# EAGLE design thermostat (EAGLE 7.3.0)
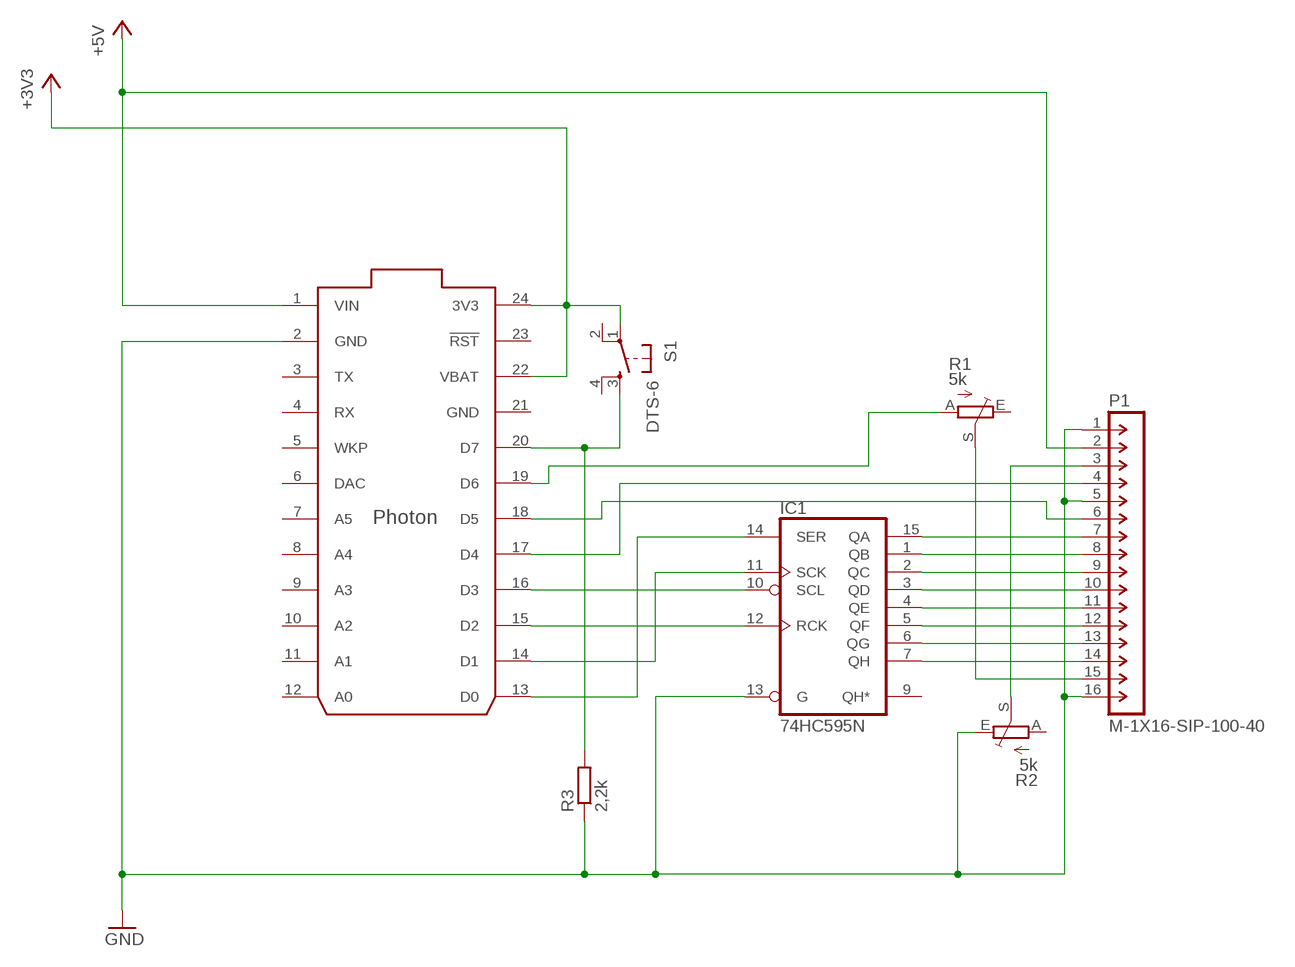
[diagram p0: schematic, sheet 1]

## Parts
IC1  74HC595N  [DIL16]
P1  M-1X16-SIP-100-40  [SIP-100-16-40]
R1  5k  TRIM_EU-B25P  [B25P]
R2  5k  TRIM_EU-B25P  [B25P]
R3  2,2k  R-EU_0207/10  [0207/10]
S1  DTS-6  [DTS-6]
U$1  PHOTON_WITH_HEADERS  [PHOTON]

## Nets
+3V3: S1.1 U$1.22(VBAT) U$1.24(3V3)
+5V: P1.2 U$1.1(VIN)
GND: IC1.13(G) P1.1 P1.5 P1.16 R2.E R3.1 U$1.2(GND)
N$1: IC1.14(SER) U$1.13(D0)
N$2: IC1.11(SCK) U$1.14(D1)
N$3: IC1.12(RCK) U$1.15(D2)
N$4: IC1.10(SCL) U$1.16(D3)
N$5: P1.4 U$1.17(D4)
N$6: P1.6 U$1.18(D5)
N$7: IC1.15(QA) P1.7
N$8: IC1.1(QB) P1.8
N$9: IC1.2(QC) P1.9
N$10: IC1.3(QD) P1.10
N$11: IC1.4(QE) P1.11
N$12: IC1.5(QF) P1.12
N$13: IC1.6(QG) P1.13
N$14: IC1.7(QH) P1.14
N$15: R3.2 S1.3 U$1.20(D7)
N$16: P1.3 R2.S
N$17: R1.A U$1.19(D6)
N$18: P1.15 R1.S
Unconnected: IC1.9(QH*) R1.E R2.A S1.2 S1.4 U$1.3(TX) U$1.4(RX) U$1.5(WKP) U$1.6(DAC) U$1.7(A5) U$1.8(A4) U$1.9(A3) U$1.10(A2) U$1.11(A1) U$1.12(A0) U$1.23(!RST)

## Power pins joined to a net without a drawn wire
GND: IC1.8(GND) U$1.21(GND)
VCC: IC1.16(VCC)

## Library data of the parts
IC1 = 74xx-eu:74*595: 8-bit SHIFT REGISTER, output latch
P1 = con-headers-jp:M-1X16-: MALE HEADER
R1 R2 = pot:TRIM_EU-: POTENTIOMETER
R3 = resistor:R-EU_: RESISTOR, European symbol
S1 = switch-tact:DTS-6
U$1 = Spark:PHOTON

## Board
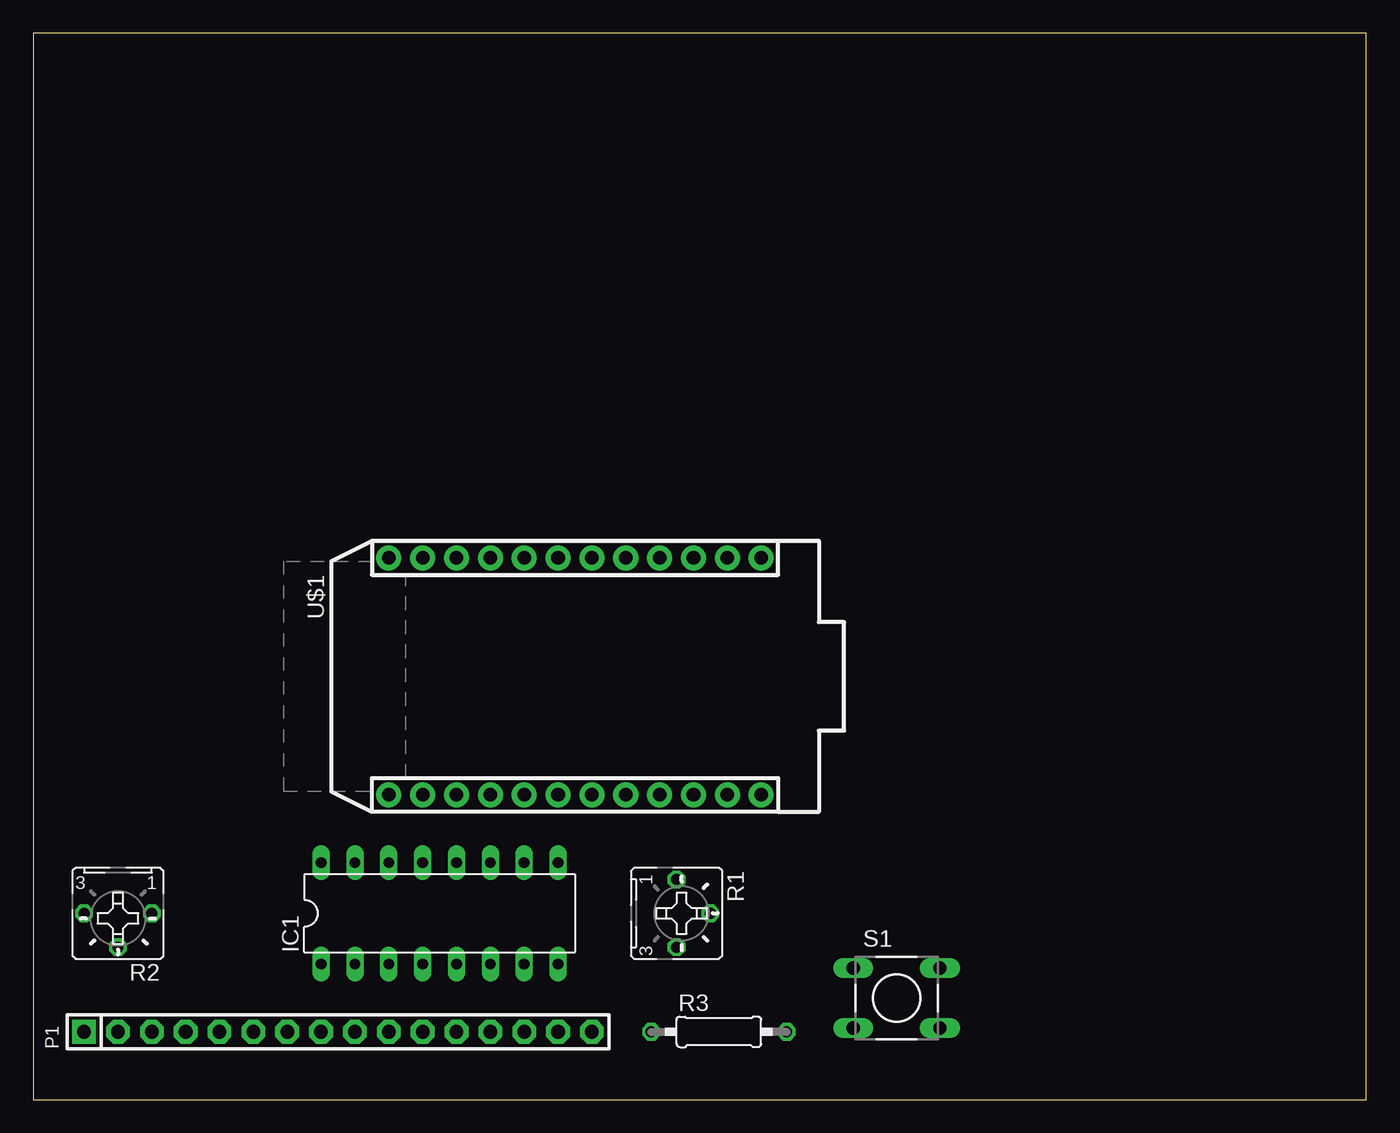
[diagram p1: board, top side]
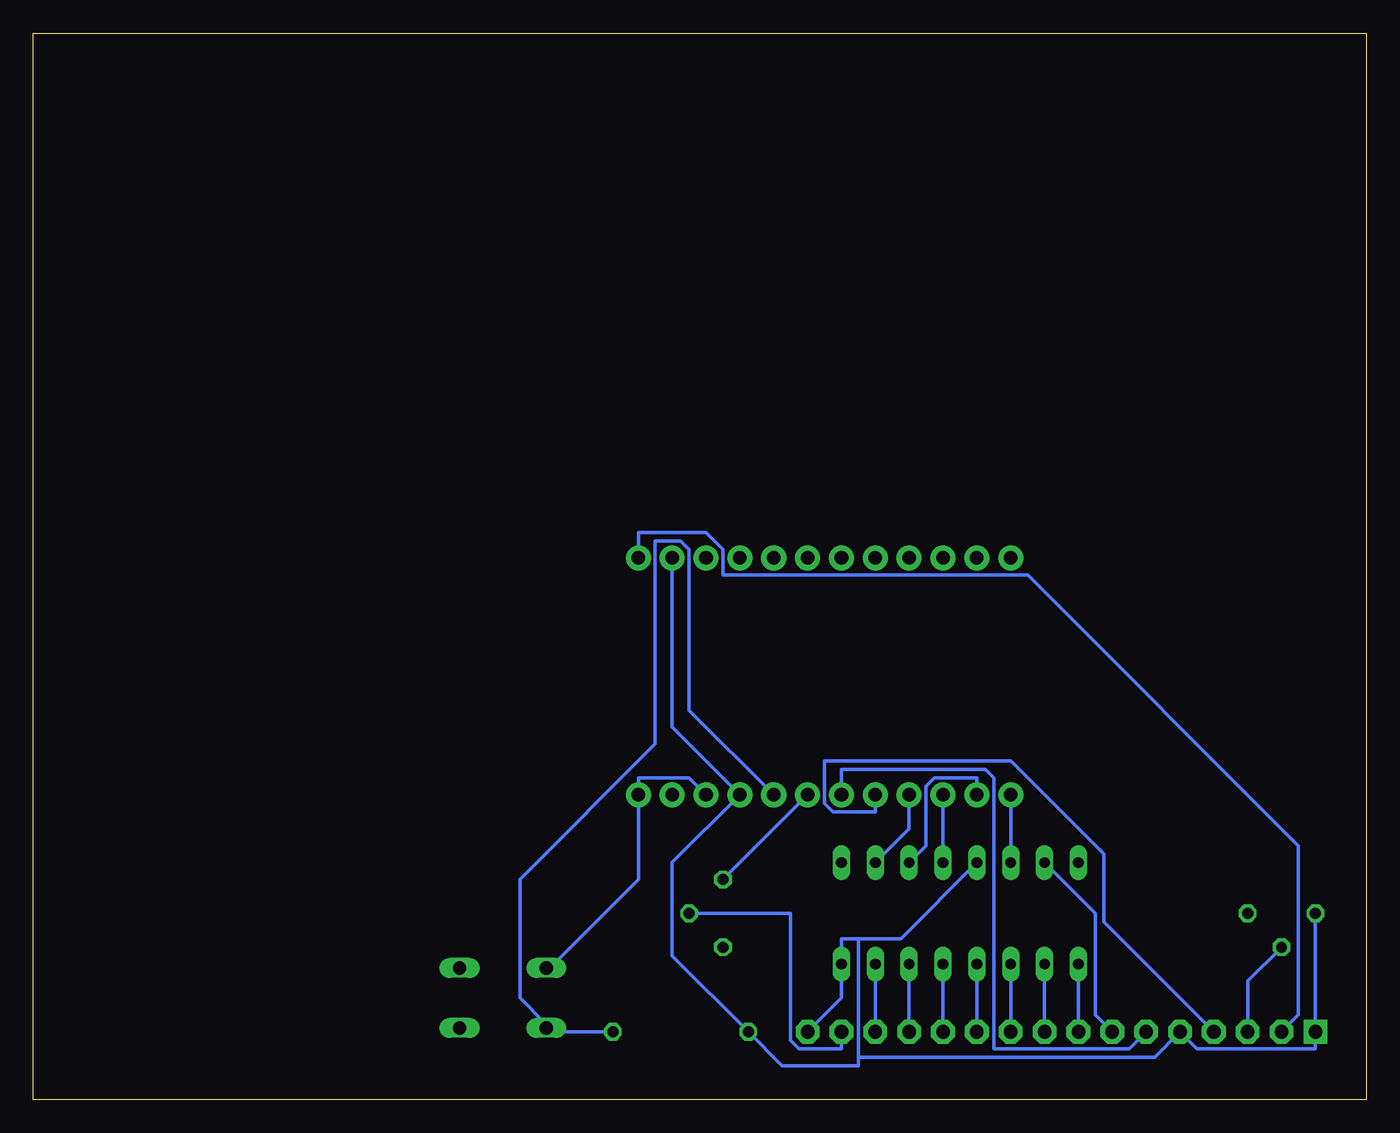
[diagram p2: board, bottom side, seen from below]

Size 100 x 80 mm. Coordinates in mm from the lower left corner, seen from the top.
Outline: 0,0 100,0 100,80 0,80 0,0
Copper layers (1*16): Top 0.035mm / dielectric 1.5mm / Bottom 0.035mm
Design rules "default": minimum track width 10mil, minimum drill 24mil, track to track 8mil, track to pad 8mil, pad to pad 8mil, via to via 8mil, smd to smd 8mil, copper to edge 40mil, drill to drill 8mil, minimum pad ring 10mil, minimum via ring 8mil, stop-mask expansion 4mil, vias tented up to drill 0mil, thermal gap 10mil

### Footprints (pad centres in the part's own frame; a part is rotated, then mirrored left to right if it is on the bottom)
DIL16 = drill 0.813 long: 1 -8.89,-3.81; 2 -6.35,-3.81; 3 -3.81,-3.81; 4 -1.27,-3.81; 5 1.27,-3.81; 6 3.81,-3.81; 7 6.35,-3.81; 8 8.89,-3.81; 9 8.89,3.81; 10 6.35,3.81; 11 3.81,3.81; 12 1.27,3.81; 13 -1.27,3.81; 14 -3.81,3.81; 15 -6.35,3.81; 16 -8.89,3.81
SIP-100-16-40 = drill 1.016 pad 1.778 square: 1 -19.05,0 | drill 1.016 pad 1.778 octagon: 2 -16.51,0; 3 -13.97,0; 4 -11.43,0; 5 -8.89,0; 6 -6.35,0; 7 -3.81,0; 8 -1.27,0; 9 1.27,0; 10 3.81,0; 11 6.35,0; 12 8.89,0; 13 11.43,0; 14 13.97,0; 15 16.51,0; 16 19.05,0
B25P = drill 0.813 octagon: A -2.54,0; E 2.54,0; S 0,2.54
0207/10 = drill 0.813 octagon: 1 -5.08,0; 2 5.08,0
DTS-6 = drill 1 long: 1 -3.25,2.25; 2 3.25,2.25; 3 -3.25,-2.25; 4 3.25,-2.25
PHOTON = drill 1.016 pad 1.88: 1 1.27,29.21; 2 1.27,26.67; 3 1.27,24.13; 4 1.27,21.59; 5 1.27,19.05; 6 1.27,16.51; 7 1.27,13.97; 8 1.27,11.43; 9 1.27,8.89; 10 1.27,6.35; 11 1.27,3.81; 12 1.27,1.27; 13 19.05,1.27; 14 19.05,3.81; 15 19.05,6.35; 16 19.05,8.89; 17 19.05,11.43; 18 19.05,13.97; 19 19.05,16.51; 20 19.05,19.05; 21 19.05,21.59; 22 19.05,24.13; 23 19.05,26.67; 24 19.05,29.21

### Placement (x,y rotation side)
IC1  30.48,13.97 0 top
P1  22.86,5.08 0 top
R1  48.26,13.97 270 top
R2  6.35,13.97 180 top
R3  51.44,5.08 0 top
S1  64.77,7.62 0 top
U$1  25.4,41.91 270 top

### Tracks (layer width: path | path; a pad name or v marks a point on that pad's centre or on a via)
+3V3
  Bottom 0.254: U$1.22 50.8,24.13 54.61,24.13 U$1.24 54.61,16.51 60.96,10.16 S1.1
+5V
  Bottom 0.254: P1.2 5.08,6.35 5.08,19.05 25.4,39.37 48.26,39.37 48.26,41.27 49.53,42.55 54.61,42.55 U$1.1
GND
  Bottom 0.254: P1.16 39.37,7.62 IC1.8 39.37,12.06 38.1,12.06 | R2.E P1.1 3.81,3.81 12.7,3.81 P1.5 15.88,3.17 38.1,3.17 | U$1.2 52.07,27.94 U$1.21 52.07,17.78 52.07,10.79 R3.1 43.81,2.54 38.1,2.54 38.1,3.17 | IC1.13 34.92,12.06 38.1,12.06 | 38.1,12.06 38.1,3.17
N$1
  Bottom 0.254: U$1.13 IC1.14
N$2
  Bottom 0.254: IC1.11 33.02,19.05 33.02,23.5 32.38,24.13 29.21,24.13 U$1.14
N$3
  Bottom 0.254: U$1.15 IC1.12
N$4
  Bottom 0.254: IC1.10 34.29,20.32 U$1.16
N$5
  Bottom 0.254: P1.4 19.68,13.34 19.68,18.41 26.67,25.4 40.64,25.4 40.64,22.23 40.01,21.59 36.83,21.59 U$1.17
N$6
  Bottom 0.254: P1.6 17.78,3.81 27.94,3.81 27.94,24.13 28.57,24.77 39.37,24.77 U$1.18
N$7
  Bottom 0.254: IC1.15 20.32,13.97 20.32,6.35 P1.7
N$8
  Bottom 0.254: P1.8 IC1.1
N$9
  Bottom 0.254: P1.9 IC1.2
N$10
  Bottom 0.254: P1.10 IC1.3
N$11
  Bottom 0.254: P1.11 IC1.4
N$12
  Bottom 0.254: P1.12 IC1.5
N$13
  Bottom 0.254: P1.13 IC1.6
N$14
  Bottom 0.254: P1.14 IC1.7
N$15
  Bottom 0.254: R3.2 60.96,5.08 S1.3 61.59,5.71 63.5,7.62 63.5,16.51 53.34,26.67 53.34,41.91 51.44,41.91 50.8,41.27 50.8,29.21 U$1.20
N$16
  Bottom 0.254: R2.S 8.89,8.89 P1.3
N$17
  Bottom 0.254: U$1.19 R1.A
N$18
  Bottom 0.254: R1.S 43.18,13.97 43.18,4.45 42.55,3.81 39.37,3.81 P1.15